# EAGLE schematic Schematic V1 (EAGLE 9.6.2)

## Sheet 1 of 4
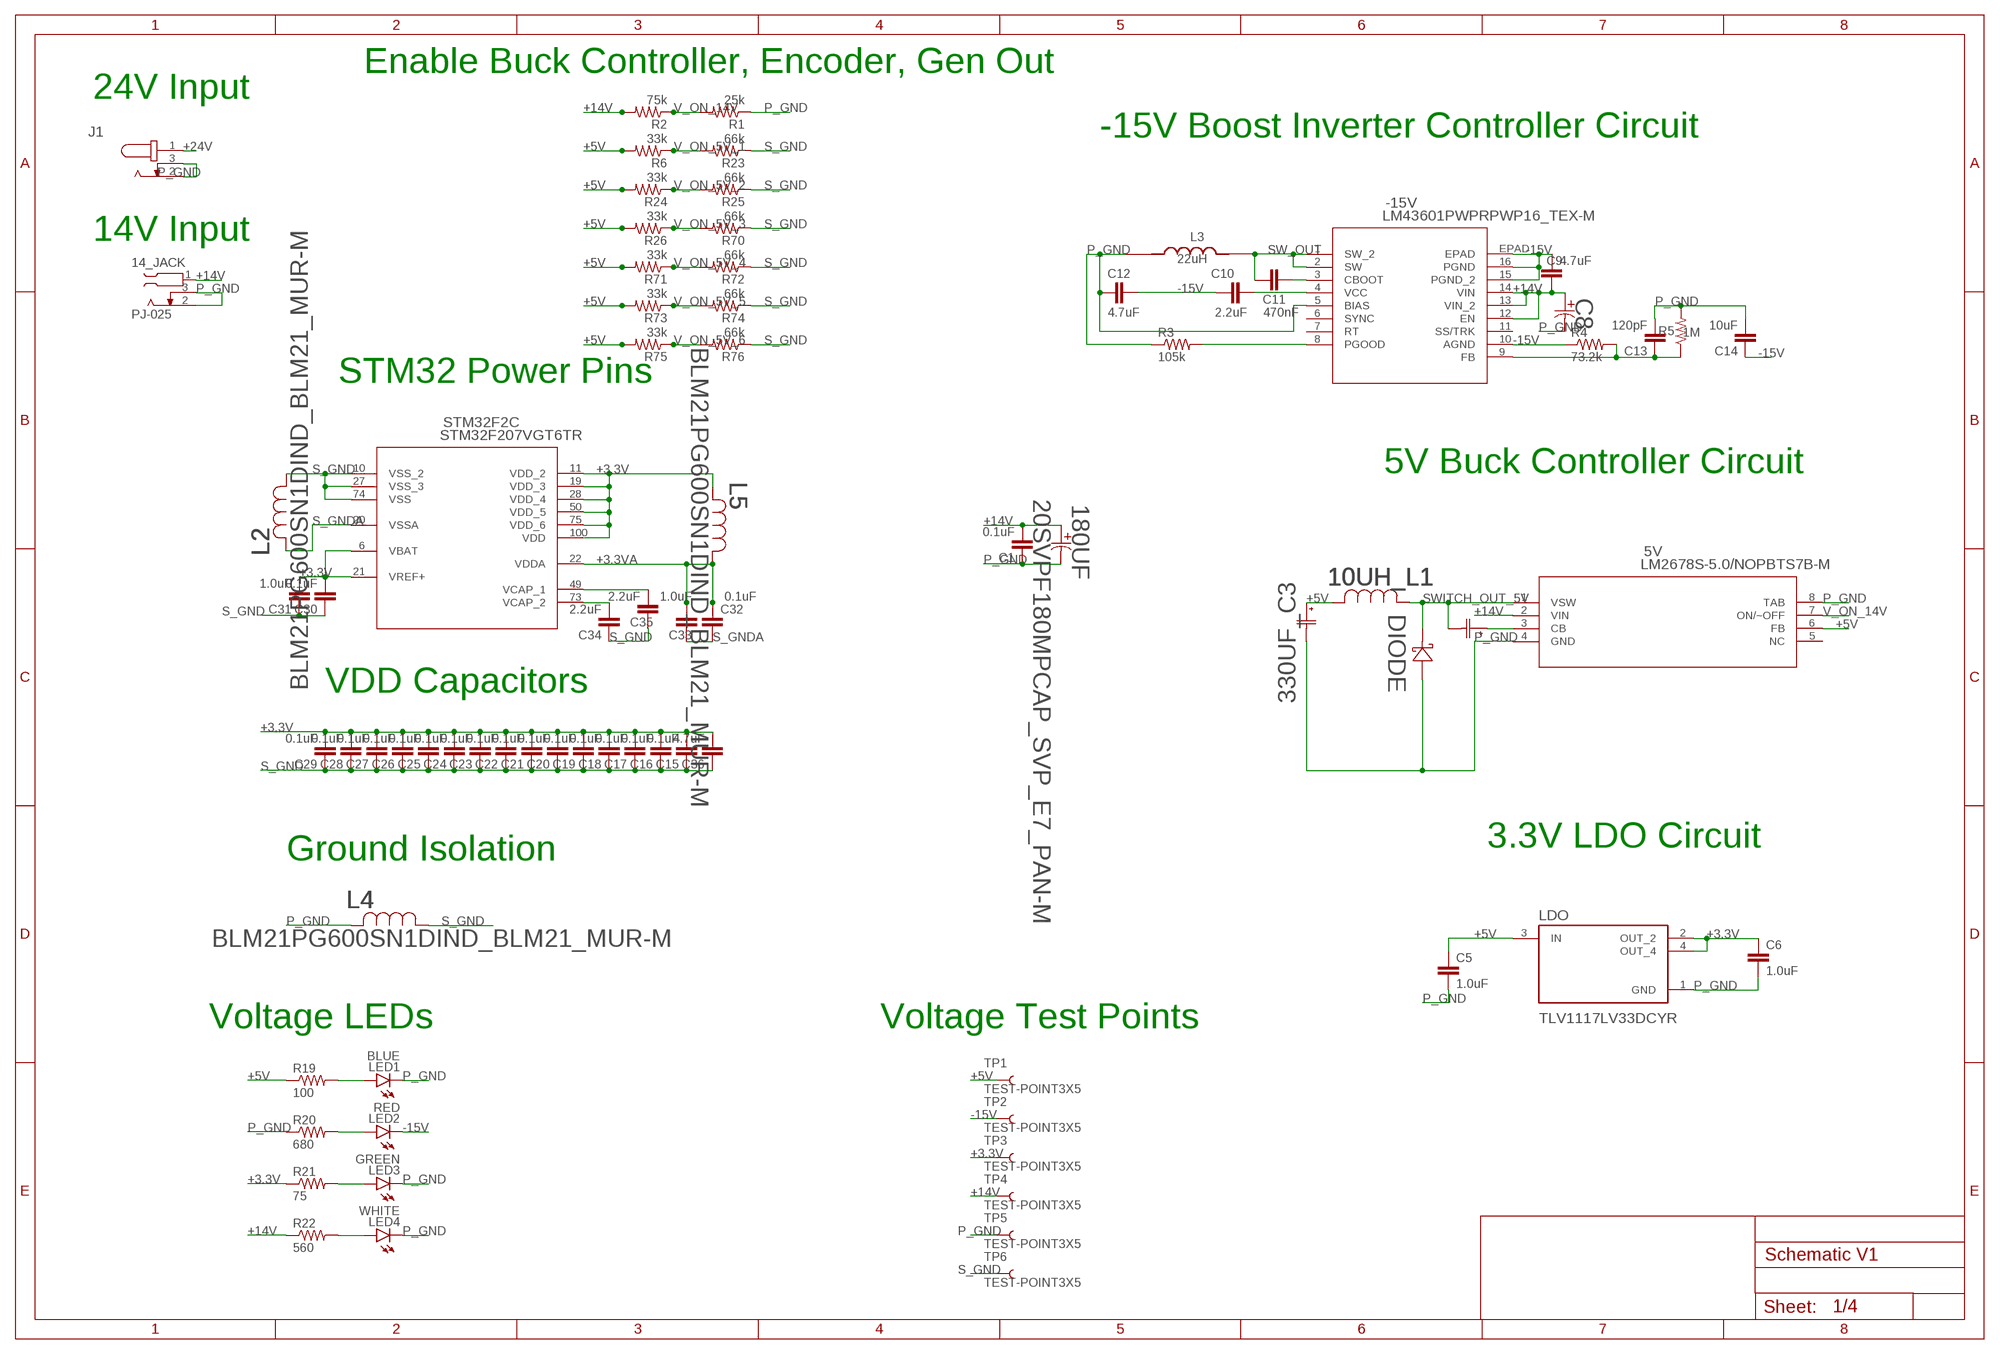
[diagram p0: schematic, sheet 1]

### Parts
0.01UF_C7  GRM2195C1H103JA01DG-21_MUR-M  [G-21_MUR-M]
5V  LM2678S-5.0/NOPBTS7B-M  [TS7B-M]
10UH_L1  SRP1270-100MIND_BOURNS_SRP1270-M  [IND_BOURNS_SRP1270-M]
14_JACK  PJ-025  [CUI_PJ-025]
180UF  20SVPF180MPCAP_SVP_E7_PAN-M  [PCAP_SVP_E7_PAN-M]
330UF_C3  10SVPC330MCAP_SVPC_E7_PAN-M  [CAP_SVPC_E7_PAN-M]
-15V  LM43601PWPRPWP16_TEX-M  [PWP16_TEX-M]
C1  0.1uF  1.0UF-0805-25V-(+80/-20%)  [0805]
C5  1.0uF  1.0UF-0805-25V-(+80/-20%)  [0805]
C6  1.0uF  1.0UF-0805-25V-(+80/-20%)  [0805]
C8  68uF  UWD1V680MCL1GSPCAP_6.3X7.7-ELECT_NCA-M  [PCAP_6.3X7.7-ELECT_NCA-M]
C9  4.7uF  4.7UF-0805-50V-(10%)  [0805]
C10  2.2uF  2.2UF-0805-25V-(+80/-20%)  [0805]
C11  470nF  470NF-0805-100V-10%-X7S  [0805]
C12  4.7uF  4.7UF-0805-50V-(10%)  [0805]
C13  120pF  4.7UF-0805-50V-(10%)  [0805]
C14  10uF  4.7UF-0805-50V-(10%)  [0805]
C15  0.1uF  1.0UF-0805-25V-10%  [0805]
C16  0.1uF  1.0UF-0805-25V-10%  [0805]
C17  0.1uF  1.0UF-0805-25V-10%  [0805]
C18  0.1uF  1.0UF-0805-25V-10%  [0805]
C19  0.1uF  1.0UF-0805-25V-10%  [0805]
C20  0.1uF  1.0UF-0805-25V-10%  [0805]
C21  0.1uF  1.0UF-0805-25V-10%  [0805]
C22  0.1uF  1.0UF-0805-25V-10%  [0805]
C23  0.1uF  1.0UF-0805-25V-10%  [0805]
C24  0.1uF  1.0UF-0805-25V-10%  [0805]
C25  0.1uF  1.0UF-0805-25V-10%  [0805]
C26  0.1uF  1.0UF-0805-25V-10%  [0805]
C27  0.1uF  1.0UF-0805-25V-10%  [0805]
C28  0.1uF  1.0UF-0805-25V-10%  [0805]
C29  0.1uF  1.0UF-0805-25V-10%  [0805]
C30  0.1uF  1.0UF-0805-25V-10%  [0805]
C31  1.0uF  1.0UF-0805-25V-10%  [0805]
C32  0.1uF  1.0UF-0805-25V-10%  [0805]
C33  1.0uF  1.0UF-0805-25V-10%  [0805]
C34  2.2uF  2.2UF-0805-25V-(+80/-20%)  [0805]
C35  2.2uF  2.2UF-0805-25V-(+80/-20%)  [0805]
C36  4.7uF  2.2UF-0805-25V-(+80/-20%)  [0805]
DIODE  CDBC520-GCDBC-G-M  [CDBC-G-M]
J1  PJ-202AH  [CUI_PJ-202AH]
L2  BLM21PG600SN1DIND_BLM21_MUR-M  [IND_BLM21_MUR-M]
L3  22uH  VLS201610CX-220M-1  [IND_VLS201610CX-220M-1]
L4  BLM21PG600SN1DIND_BLM21_MUR-M  [IND_BLM21_MUR-M]
L5  BLM21PG600SN1DIND_BLM21_MUR-M  [IND_BLM21_MUR-M]
LDO  TLV1117LV33DCYR  [VREG_TLV1117LV33DCYR]
LED1  BLUE  LEDCHIPLED_0805  [CHIPLED_0805]
LED2  RED  LEDCHIPLED_0805  [CHIPLED_0805]
LED3  GREEN  LEDCHIPLED_0805  [CHIPLED_0805]
LED4  WHITE  LEDCHIPLED_0805  [CHIPLED_0805]
R1  25k  R-US_R0805  [R0805]
R2  75k  R-US_R0805  [R0805]
R3  105k  R-US_R0805  [R0805]
R4  73.2k  R-US_R0805  [R0805]
R5  1M  R-US_R0805  [R0805]
R6  33k  R-US_R0805  [R0805]
R19  100  R-US_R0805  [R0805]
R20  680  R-US_R0805  [R0805]
R21  75  R-US_R0805  [R0805]
R22  560  R-US_R0805  [R0805]
R23  66k  R-US_R0805  [R0805]
R24  33k  R-US_R0805  [R0805]
R25  66k  R-US_R0805  [R0805]
R26  33k  R-US_R0805  [R0805]
R70  66k  R-US_R0805  [R0805]
R71  33k  R-US_R0805  [R0805]
R72  66k  R-US_R0805  [R0805]
R73  33k  R-US_R0805  [R0805]
R74  66k  R-US_R0805  [R0805]
R75  33k  R-US_R0805  [R0805]
R76  66k  R-US_R0805  [R0805]
STM32F2  STM32F207VGT6TR  [LQFP100-14X14MM]
TP1  TEST-POINT3X5  [PAD.03X.05]
TP2  TEST-POINT3X5  [PAD.03X.05]
TP3  TEST-POINT3X5  [PAD.03X.05]
TP4  TEST-POINT3X5  [PAD.03X.05]
TP5  TEST-POINT3X5  [PAD.03X.05]
TP6  TEST-POINT3X5  [PAD.03X.05]

### Nets
+3.3V: C6.1 C15.2 C16.2 C17.2 C18.2 C19.2 C20.2 C21.2 C22.2 C23.2 C24.2 C25.2 C26.2 C27.2 C28.2 C29.2 C30.2 C31.2 C36.2 L5.2 LDO.2(OUT_2) LDO.4(OUT_4) R21.1 STM32F2.6(C:VBAT) STM32F2.11(C:VDD_2) STM32F2.19(C:VDD_3) STM32F2.21(C:VREF+) STM32F2.28(C:VDD_4) STM32F2.50(C:VDD_5) STM32F2.75(C:VDD_6) STM32F2.100(C:VDD) TP3.1 ; also sheet 3,4
+3.3VA: C32.2 C33.2 L5.1 STM32F2.22(C:VDDA)
+5V: 5V.6(FB) 10UH_L1.2 330UF_C3.1 C5.1 LDO.3(IN) R6.2 R19.1 R24.2 R26.2 R71.2 R73.2 R75.2 TP1.1 ; also sheet 2,3
+14V: 5V.2(VIN) 14_JACK.1 180UF.1 -15V.12(EN) -15V.13(VIN_2) -15V.14(VIN) C1.2 C8.1 C9.2 R2.2 R22.1 TP4.1 ; also sheet 2,3
+24V: J1.1 ; also sheet 2,3,4
-15V: -15V.10(AGND) -15V.15(PGND_2) -15V.16(PGND) -15V.EPAD C9.1 C10.1 C12.1 C14.1 LED2.C R4.1 TP2.1 ; also sheet 2
N$1: -15V.4(VCC) C10.2
N$2: 0.01UF_C7.1 5V.3(CB)
N$3: -15V.3(CBOOT) C11.2
N$4: C35.2 STM32F2.49(C:VCAP_1)
N$5: C34.2 STM32F2.73(C:VCAP_2)
N$7: -15V.8(PGOOD) R3.2
N$11: -15V.9(FB) C13.1 R4.2 R5.1
N$22: LED1.A R19.2
N$23: LED2.A R20.2
N$24: LED3.A R21.2
N$30: LED4.A R22.2
P_GND: 5V.4(GND) 5V.8(TAB) 14_JACK.2 14_JACK.3 180UF.2 330UF_C3.2 -15V.5(BIAS) C1.1 C5.2 C6.2 C8.2 C12.2 C13.2 C14.2 DIODE.2 J1.2 J1.3 L3.1 L4.2 LDO.1(GND) LED1.C LED3.C LED4.C R1.1 R3.1 R5.2 R20.1 TP5.1 ; also sheet 2,4
S_GND: C15.1 C16.1 C17.1 C18.1 C19.1 C20.1 C21.1 C22.1 C23.1 C24.1 C25.1 C26.1 C27.1 C28.1 C29.1 C30.1 C31.1 C34.1 C35.1 C36.1 L2.1 L4.1 R23.1 R25.1 R70.1 R72.1 R74.1 R76.1 STM32F2.10(C:VSS_2) STM32F2.27(C:VSS_3) STM32F2.74(C:VSS) TP6.1 ; also sheet 2,3,4
S_GNDA: C32.1 C33.1 L2.2 STM32F2.20(C:VSSA)
SW_OUT: -15V.1(SW_2) -15V.2(SW) C11.1 L3.2
SWITCH_OUT_5V: 0.01UF_C7.2 5V.1(VSW) 10UH_L1.1 DIODE.1
V_ON_5V_1: R6.1 R23.2 ; also sheet 3
V_ON_5V_2: R24.1 R25.2 ; also sheet 2
V_ON_5V_3: R26.1 R70.2 ; also sheet 3
V_ON_5V_4: R71.1 R72.2 ; also sheet 3
V_ON_5V_5: R73.1 R74.2 ; also sheet 3
V_ON_5V_6: R75.1 R76.2 ; also sheet 2
V_ON_14V: 5V.7(ON/~OFF) R1.2 R2.1
Unconnected: 5V.5(NC) -15V.6(SYNC) -15V.7(RT) -15V.11(SS/TRK)

### Notes on the sheet
- Enable Buck Controller, Encoder, Gen Out
- 24V Input
- -15V Boost Inverter Controller Circuit
- 14V Input
- STM32 Power Pins
- 5V Buck Controller Circuit
- VDD Capacitors
- 3.3V LDO Circuit
- Ground Isolation
- Voltage LEDs | Voltage Test Points

## Sheet 2 of 4
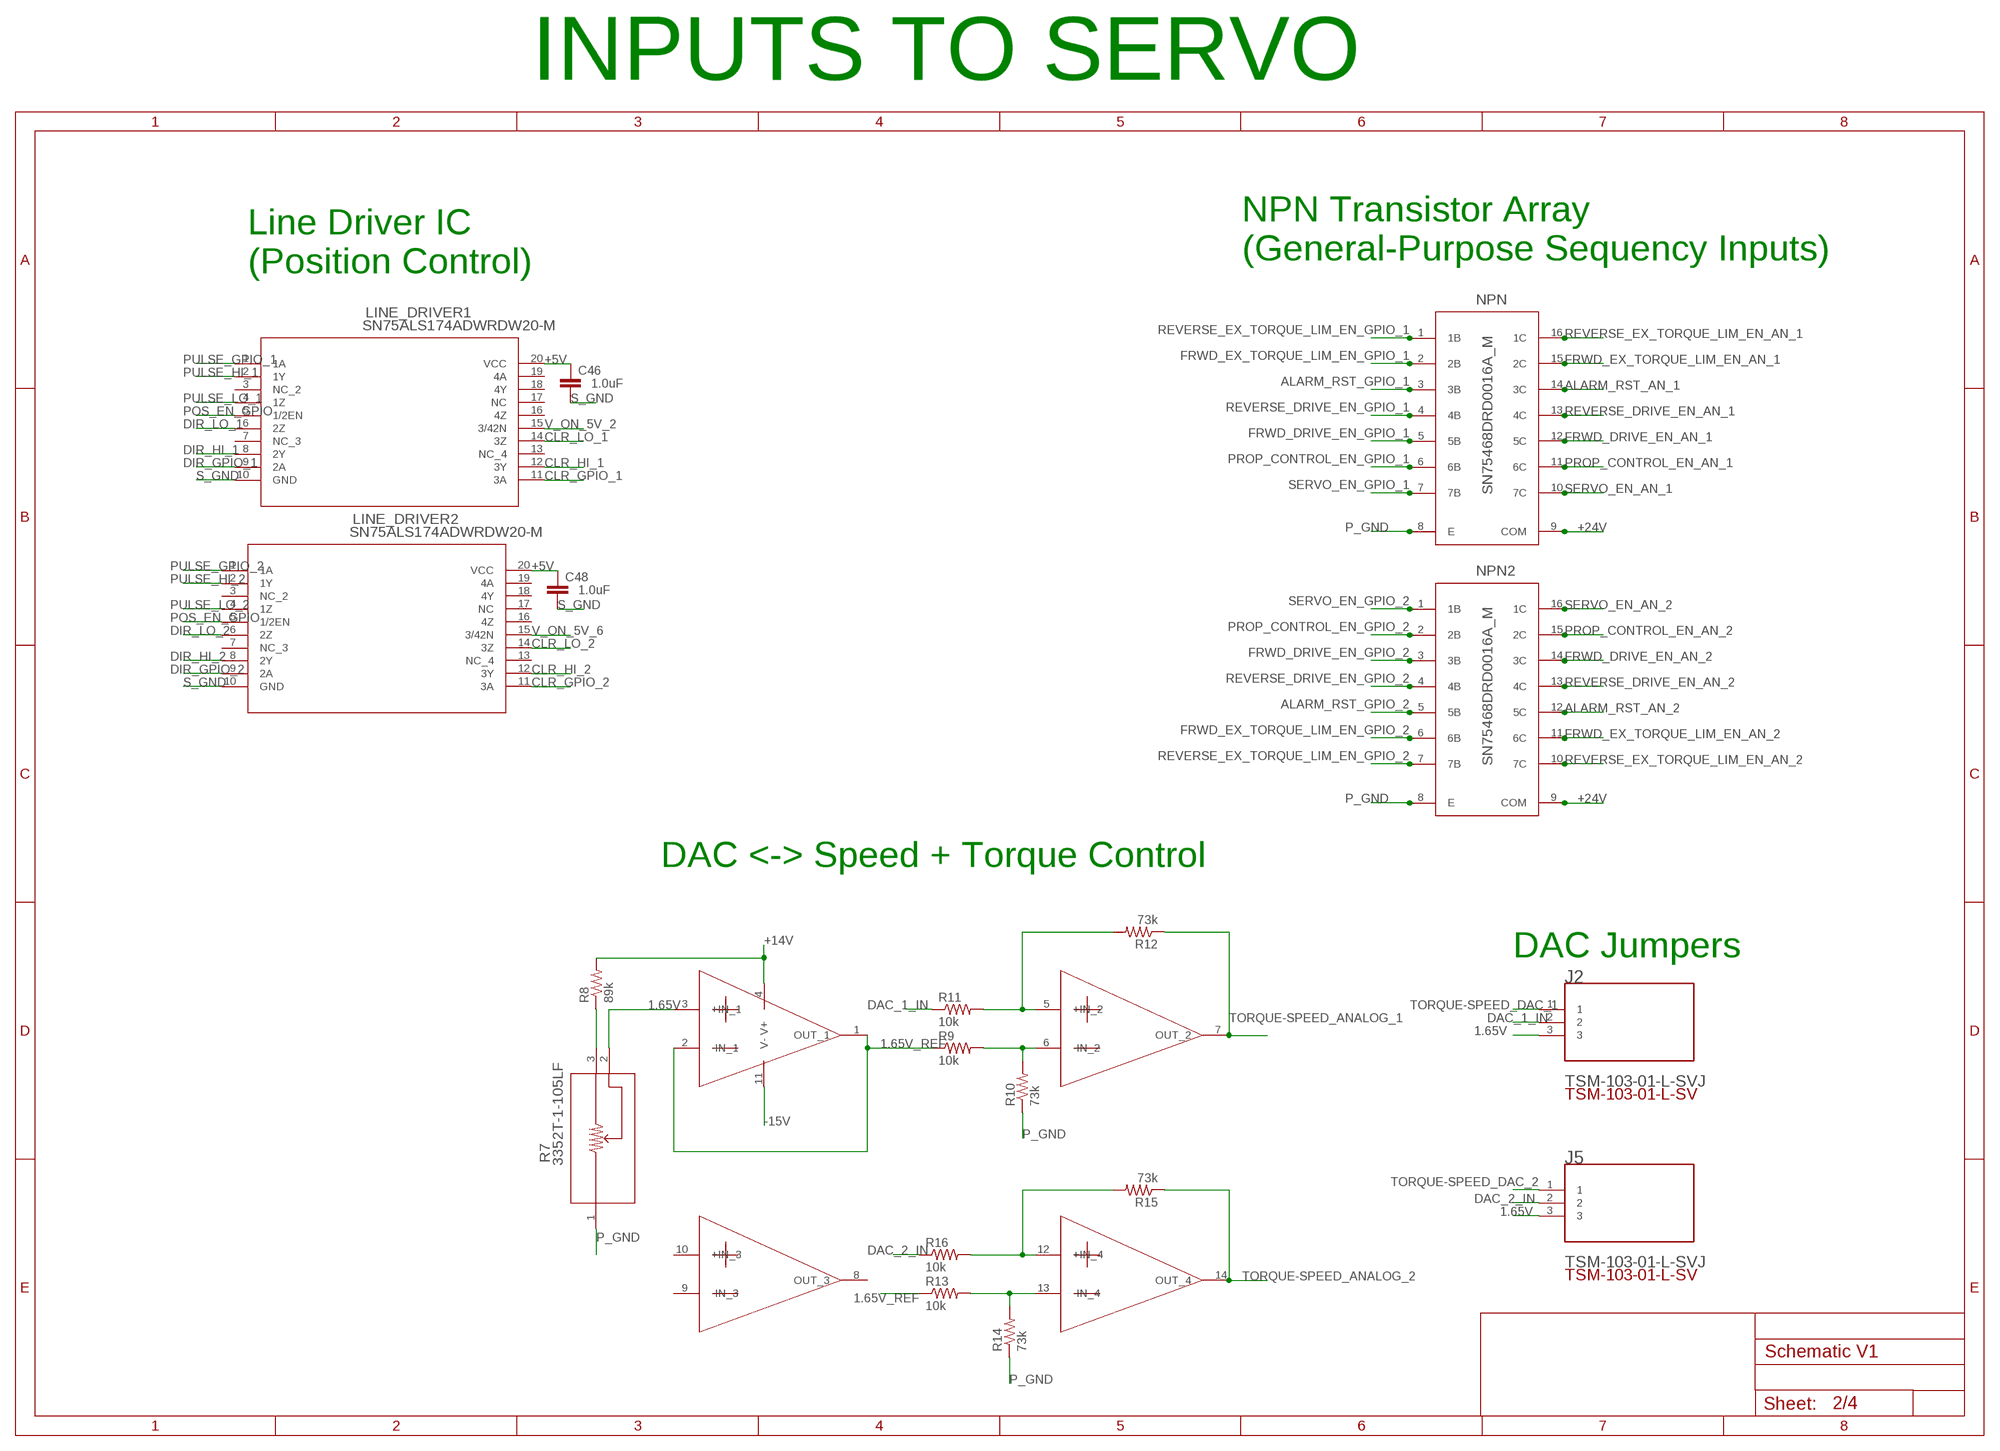
[diagram p1: schematic, sheet 2]

### Parts
C46  1.0uF  1.0UF-0805-25V-10%  [0805]
C48  1.0uF  1.0UF-0805-25V-10%  [0805]
J2  TSM-103-01-L-SVJ  [TSM-103-01-L-SV]
J5  TSM-103-01-L-SVJ  [TSM-103-01-L-SV]
LINE_DRIVER1  SN75ALS174ADWRDW20-M  [DW20-M]
LINE_DRIVER2  SN75ALS174ADWRDW20-M  [DW20-M]
NPN  SN75468DRD0016A_M  [D0016A_M]
NPN2  SN75468DRD0016A_M  [D0016A_M]
OP_AMP  OPA4205APWRTSSOP14_PW_R-PDSO-G14_TEX-M  [TSSOP14_PW_R-PDSO-G14_TEX-M]
R7  3352T-1-105LF  [3352T_BRN]
R8  89k  R-US_R0805  [R0805]
R9  10k  R-US_R0805  [R0805]
R10  73k  R-US_R0805  [R0805]
R11  10k  R-US_R0805  [R0805]
R12  73k  R-US_R0805  [R0805]
R13  10k  R-US_R0805  [R0805]
R14  73k  R-US_R0805  [R0805]
R15  73k  R-US_R0805  [R0805]
R16  10k  R-US_R0805  [R0805]

### Nets
1.65V: J2.3 J5.3 OP_AMP.3(+IN_1) R7.2
1.65V_REF: OP_AMP.1(OUT_1) OP_AMP.2(-IN_1) R9.1 R13.1
+5V: C46.2 C48.2 LINE_DRIVER1.20(VCC) LINE_DRIVER2.20(VCC) ; also sheet 1,3
+14V: OP_AMP.4(V+) R8.2 ; also sheet 1,3
+24V: NPN2.9(COM) NPN.9(COM) ; also sheet 1,3,4
-15V: OP_AMP.11(V-) ; also sheet 1
ALARM_RST_AN_1: NPN.14(3C) ; also sheet 4
ALARM_RST_AN_2: NPN2.12(5C) ; also sheet 4
ALARM_RST_GPIO_1: NPN.3(3B) ; also sheet 4
ALARM_RST_GPIO_2: NPN2.5(5B) ; also sheet 4
CLR_GPIO_1: LINE_DRIVER1.11(3A) ; also sheet 4
CLR_GPIO_2: LINE_DRIVER2.11(3A) ; also sheet 4
CLR_HI_1: LINE_DRIVER1.12(3Y) ; also sheet 4
CLR_HI_2: LINE_DRIVER2.12(3Y) ; also sheet 4
CLR_LO_1: LINE_DRIVER1.14(3Z) ; also sheet 4
CLR_LO_2: LINE_DRIVER2.14(3Z) ; also sheet 4
DAC_1_IN: J2.2 R11.1
DAC_2_IN: J5.2 R16.1
DIR_GPIO_1: LINE_DRIVER1.9(2A) ; also sheet 4
DIR_GPIO_2: LINE_DRIVER2.9(2A) ; also sheet 4
DIR_HI_1: LINE_DRIVER1.8(2Y) ; also sheet 4
DIR_HI_2: LINE_DRIVER2.8(2Y) ; also sheet 4
DIR_LO_1: LINE_DRIVER1.6(2Z) ; also sheet 4
DIR_LO_2: LINE_DRIVER2.6(2Z) ; also sheet 4
FRWD_DRIVE_EN_AN_1: NPN.12(5C) ; also sheet 4
FRWD_DRIVE_EN_AN_2: NPN2.14(3C) ; also sheet 4
FRWD_DRIVE_EN_GPIO_1: NPN.5(5B) ; also sheet 4
FRWD_DRIVE_EN_GPIO_2: NPN2.3(3B) ; also sheet 4
FRWD_EX_TORQUE_LIM_EN_AN_1: NPN.15(2C) ; also sheet 4
FRWD_EX_TORQUE_LIM_EN_AN_2: NPN2.11(6C) ; also sheet 4
FRWD_EX_TORQUE_LIM_EN_GPIO_1: NPN.2(2B) ; also sheet 4
FRWD_EX_TORQUE_LIM_EN_GPIO_2: NPN2.6(6B) ; also sheet 4
N$8: OP_AMP.6(-IN_2) R9.2 R10.2
N$13: R7.3 R8.1
N$15: OP_AMP.5(+IN_2) R11.2 R12.2
N$17: OP_AMP.13(-IN_4) R13.2 R14.2
N$18: OP_AMP.12(+IN_4) R15.2 R16.2
P_GND: NPN2.8(E) NPN.8(E) R7.1 R10.1 R14.1 ; also sheet 1,4
POS_EN_GPIO: LINE_DRIVER1.5(1/2EN) LINE_DRIVER2.5(1/2EN) ; also sheet 4
PROP_CONTROL_EN_AN_1: NPN.11(6C) ; also sheet 4
PROP_CONTROL_EN_AN_2: NPN2.15(2C) ; also sheet 4
PROP_CONTROL_EN_GPIO_1: NPN.6(6B) ; also sheet 4
PROP_CONTROL_EN_GPIO_2: NPN2.2(2B) ; also sheet 4
PULSE_GPIO_1: LINE_DRIVER1.1(1A) ; also sheet 4
PULSE_GPIO_2: LINE_DRIVER2.1(1A) ; also sheet 4
PULSE_HI_1: LINE_DRIVER1.2(1Y) ; also sheet 4
PULSE_HI_2: LINE_DRIVER2.2(1Y) ; also sheet 4
PULSE_LO_1: LINE_DRIVER1.4(1Z) ; also sheet 4
PULSE_LO_2: LINE_DRIVER2.4(1Z) ; also sheet 4
REVERSE_DRIVE_EN_AN_1: NPN.13(4C) ; also sheet 4
REVERSE_DRIVE_EN_AN_2: NPN2.13(4C) ; also sheet 4
REVERSE_DRIVE_EN_GPIO_1: NPN.4(4B) ; also sheet 4
REVERSE_DRIVE_EN_GPIO_2: NPN2.4(4B) ; also sheet 4
REVERSE_EX_TORQUE_LIM_EN_AN_1: NPN.16(1C) ; also sheet 4
REVERSE_EX_TORQUE_LIM_EN_AN_2: NPN2.10(7C) ; also sheet 4
REVERSE_EX_TORQUE_LIM_EN_GPIO_1: NPN.1(1B) ; also sheet 4
REVERSE_EX_TORQUE_LIM_EN_GPIO_2: NPN2.7(7B) ; also sheet 4
S_GND: C46.1 C48.1 LINE_DRIVER1.10(GND) LINE_DRIVER2.10(GND) ; also sheet 1,3,4
SERVO_EN_AN_1: NPN.10(7C) ; also sheet 4
SERVO_EN_AN_2: NPN2.16(1C) ; also sheet 4
SERVO_EN_GPIO_1: NPN.7(7B) ; also sheet 4
SERVO_EN_GPIO_2: NPN2.1(1B) ; also sheet 4
TORQUE-SPEED_ANALOG_1: OP_AMP.7(OUT_2) R12.1 ; also sheet 4
TORQUE-SPEED_ANALOG_2: OP_AMP.14(OUT_4) R15.1 ; also sheet 4
TORQUE-SPEED_DAC_1: J2.1 ; also sheet 4
TORQUE-SPEED_DAC_2: J5.1 ; also sheet 4
V_ON_5V_2: LINE_DRIVER1.15(3/42N) ; also sheet 1
V_ON_5V_6: LINE_DRIVER2.15(3/42N) ; also sheet 1
Unconnected: LINE_DRIVER1.3(NC_2) LINE_DRIVER1.7(NC_3) LINE_DRIVER1.13(NC_4) LINE_DRIVER1.16(4Z) LINE_DRIVER1.17(NC) LINE_DRIVER1.18(4Y) LINE_DRIVER1.19(4A) LINE_DRIVER2.3(NC_2) LINE_DRIVER2.7(NC_3) LINE_DRIVER2.13(NC_4) LINE_DRIVER2.16(4Z) LINE_DRIVER2.17(NC) LINE_DRIVER2.18(4Y) LINE_DRIVER2.19(4A) OP_AMP.8(OUT_3) OP_AMP.9(-IN_3) OP_AMP.10(+IN_3)

### Notes on the sheet
- INPUTS TO SERVO
- NPN Transistor Array
  (General-Purpose Sequency Inputs)
- Line Driver IC
  (Position Control)
- DAC <-> Speed + Torque Control
- DAC Jumpers

## Sheet 3 of 4
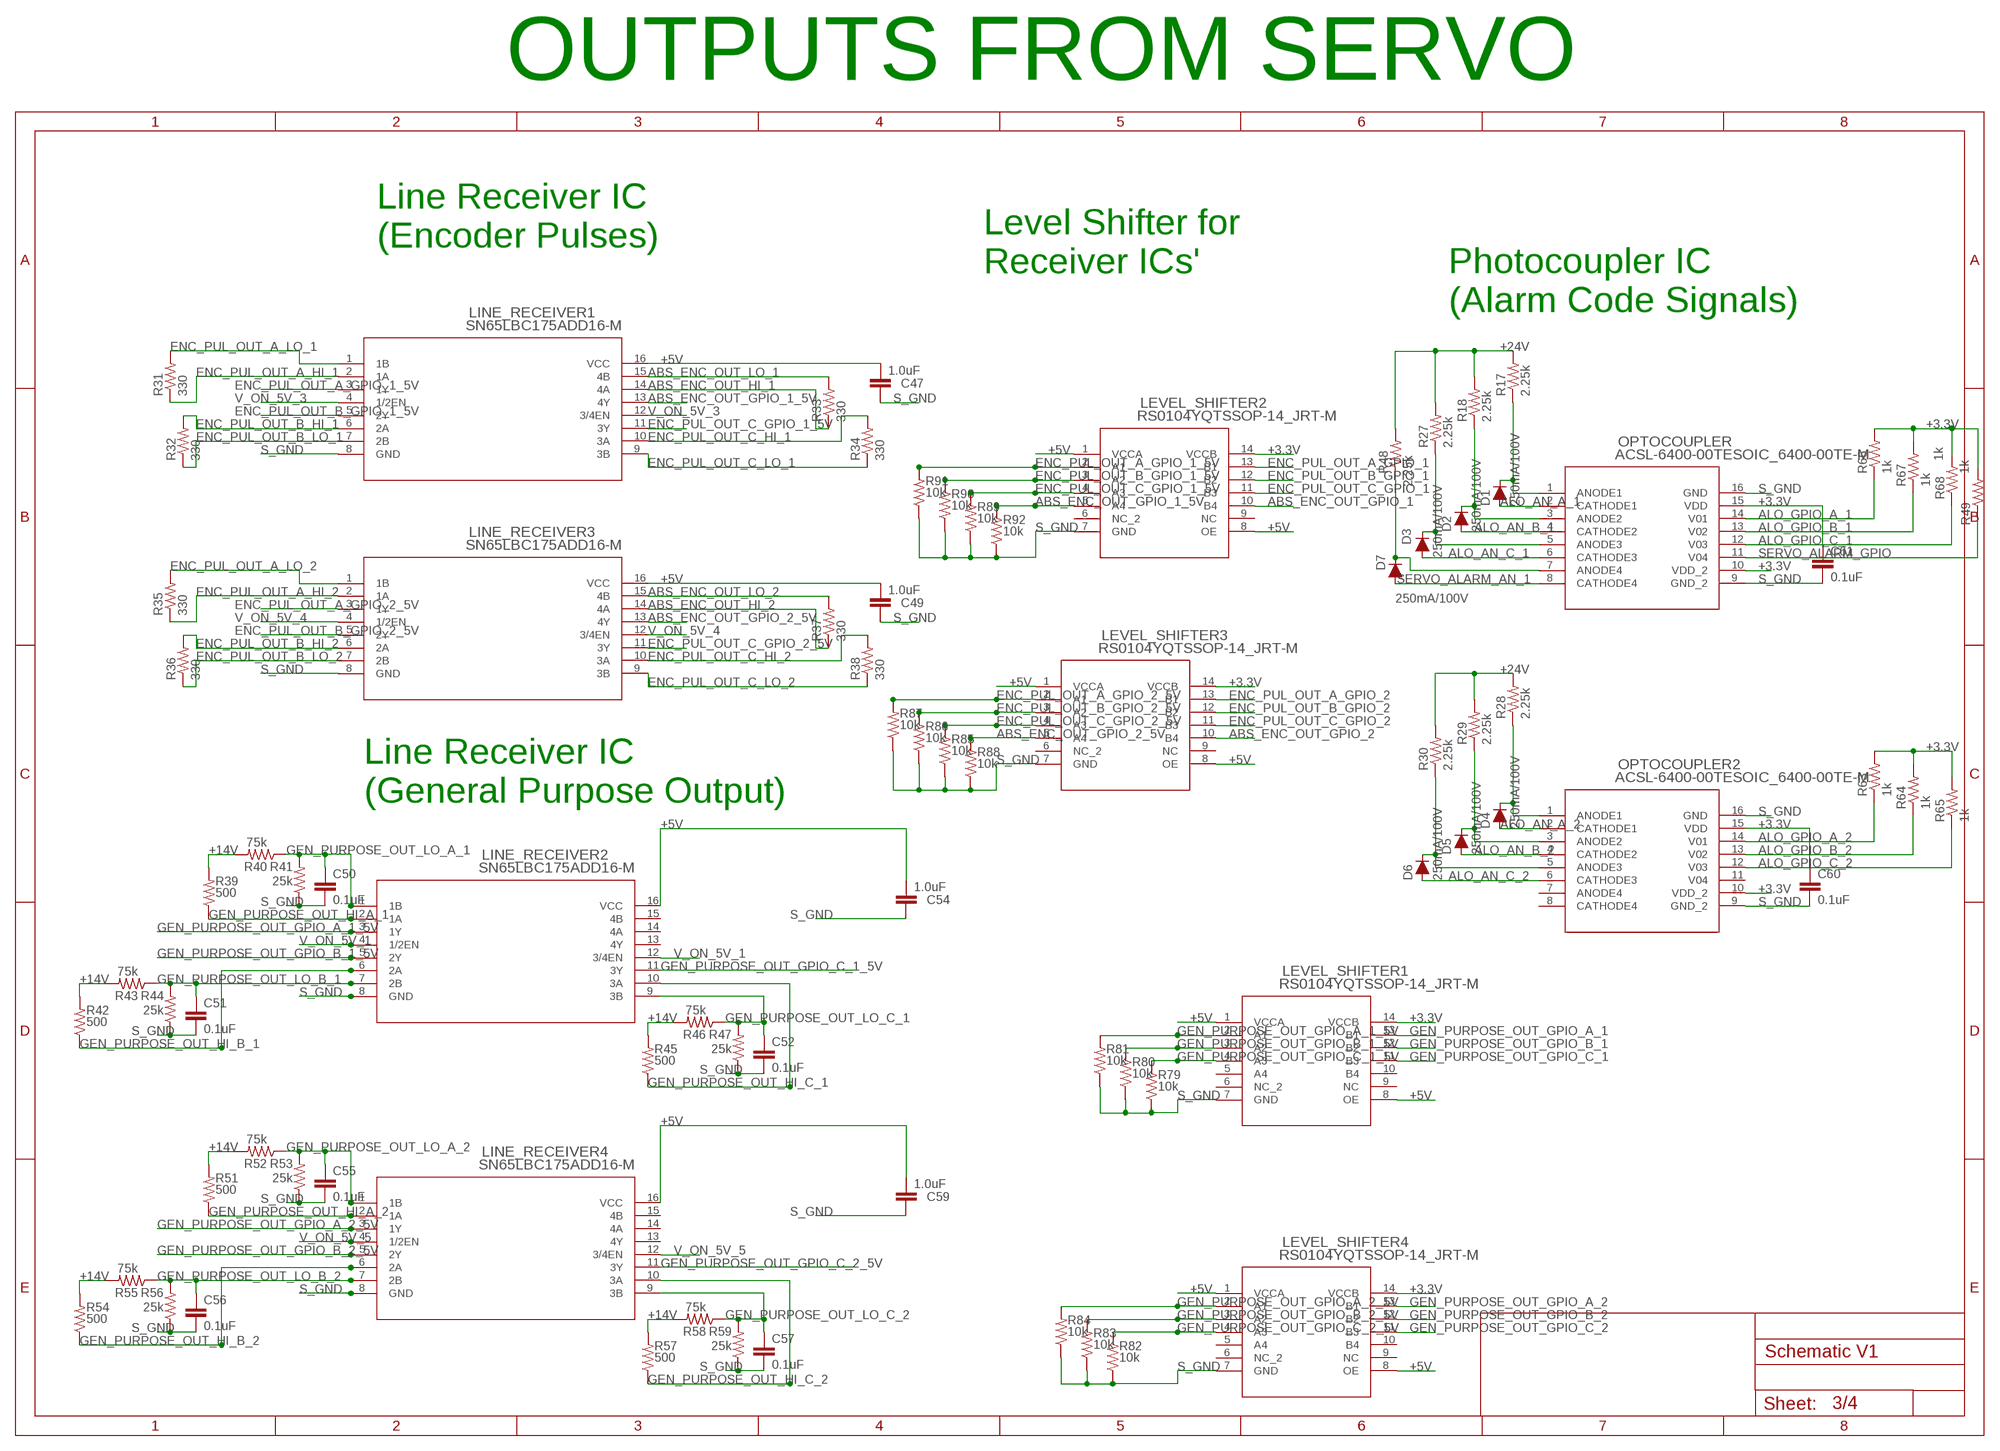
[diagram p2: schematic, sheet 3]

### Parts
C47  1.0uF  1.0UF-0805-25V-10%  [0805]
C49  1.0uF  1.0UF-0805-25V-10%  [0805]
C50  0.1uF  1.0UF-0805-25V-10%  [0805]
C51  0.1uF  1.0UF-0805-25V-10%  [0805]
C52  0.1uF  1.0UF-0805-25V-10%  [0805]
C54  1.0uF  1.0UF-0805-25V-10%  [0805]
C55  0.1uF  1.0UF-0805-25V-10%  [0805]
C56  0.1uF  1.0UF-0805-25V-10%  [0805]
C57  0.1uF  1.0UF-0805-25V-10%  [0805]
C59  1.0uF  1.0UF-0805-25V-10%  [0805]
C60  0.1uF  1.0UF-0805-25V-10%  [0805]
C61  0.1uF  1.0UF-0805-25V-10%  [0805]
D1  250mA/100V  DIODE-BAS16J  [SOD-323]
D2  250mA/100V  DIODE-BAS16J  [SOD-323]
D3  250mA/100V  DIODE-BAS16J  [SOD-323]
D4  250mA/100V  DIODE-BAS16J  [SOD-323]
D5  250mA/100V  DIODE-BAS16J  [SOD-323]
D6  250mA/100V  DIODE-BAS16J  [SOD-323]
D7  250mA/100V  DIODE-BAS16J  [SOD-323]
LEVEL_SHIFTER1  RS0104YQTSSOP-14_JRT-M  [TSSOP-14_JRT-M]
LEVEL_SHIFTER2  RS0104YQTSSOP-14_JRT-M  [TSSOP-14_JRT-M]
LEVEL_SHIFTER3  RS0104YQTSSOP-14_JRT-M  [TSSOP-14_JRT-M]
LEVEL_SHIFTER4  RS0104YQTSSOP-14_JRT-M  [TSSOP-14_JRT-M]
LINE_RECEIVER1  SN65LBC175ADD16-M  [D16-M]
LINE_RECEIVER2  SN65LBC175ADD16-M  [D16-M]
LINE_RECEIVER3  SN65LBC175ADD16-M  [D16-M]
LINE_RECEIVER4  SN65LBC175ADD16-M  [D16-M]
OPTOCOUPLER  ACSL-6400-00TESOIC_6400-00TE-M  [SOIC_6400-00TE-M]
OPTOCOUPLER2  ACSL-6400-00TESOIC_6400-00TE-M  [SOIC_6400-00TE-M]
R17  2.25k  R-US_R0805  [R0805]
R18  2.25k  R-US_R0805  [R0805]
R27  2.25k  R-US_R0805  [R0805]
R28  2.25k  R-US_R0805  [R0805]
R29  2.25k  R-US_R0805  [R0805]
R30  2.25k  R-US_R0805  [R0805]
R31  330  R-US_R0805  [R0805]
R32  330  R-US_R0805  [R0805]
R33  330  R-US_R0805  [R0805]
R34  330  R-US_R0805  [R0805]
R35  330  R-US_R0805  [R0805]
R36  330  R-US_R0805  [R0805]
R37  330  R-US_R0805  [R0805]
R38  330  R-US_R0805  [R0805]
R39  500  R-US_R0805  [R0805]
R40  75k  R-US_R0805  [R0805]
R41  25k  R-US_R0805  [R0805]
R42  500  R-US_R0805  [R0805]
R43  75k  R-US_R0805  [R0805]
R44  25k  R-US_R0805  [R0805]
R45  500  R-US_R0805  [R0805]
R46  75k  R-US_R0805  [R0805]
R47  25k  R-US_R0805  [R0805]
R48  2.25k  R-US_R0805  [R0805]
R49  1k  R-US_R0805  [R0805]
R51  500  R-US_R0805  [R0805]
R52  75k  R-US_R0805  [R0805]
R53  25k  R-US_R0805  [R0805]
R54  500  R-US_R0805  [R0805]
R55  75k  R-US_R0805  [R0805]
R56  25k  R-US_R0805  [R0805]
R57  500  R-US_R0805  [R0805]
R58  75k  R-US_R0805  [R0805]
R59  25k  R-US_R0805  [R0805]
R63  1k  R-US_R0805  [R0805]
R64  1k  R-US_R0805  [R0805]
R65  1k  R-US_R0805  [R0805]
R66  1k  R-US_R0805  [R0805]
R67  1k  R-US_R0805  [R0805]
R68  1k  R-US_R0805  [R0805]
R79  10k  R-US_R0805  [R0805]
R80  10k  R-US_R0805  [R0805]
R81  10k  R-US_R0805  [R0805]
R82  10k  R-US_R0805  [R0805]
R83  10k  R-US_R0805  [R0805]
R84  10k  R-US_R0805  [R0805]
R85  10k  R-US_R0805  [R0805]
R86  10k  R-US_R0805  [R0805]
R87  10k  R-US_R0805  [R0805]
R88  10k  R-US_R0805  [R0805]
R89  10k  R-US_R0805  [R0805]
R90  10k  R-US_R0805  [R0805]
R91  10k  R-US_R0805  [R0805]
R92  10k  R-US_R0805  [R0805]

### Nets
+3.3V: C60.2 C61.2 LEVEL_SHIFTER1.14(VCCB) LEVEL_SHIFTER2.14(VCCB) LEVEL_SHIFTER3.14(VCCB) LEVEL_SHIFTER4.14(VCCB) OPTOCOUPLER2.10(VDD_2) OPTOCOUPLER2.15(VDD) OPTOCOUPLER.10(VDD_2) OPTOCOUPLER.15(VDD) R49.2 R63.2 R64.2 R65.2 R66.2 R67.2 R68.2 ; also sheet 1,4
+5V: C47.2 C49.2 C54.2 C59.2 LEVEL_SHIFTER1.1(VCCA) LEVEL_SHIFTER1.8(OE) LEVEL_SHIFTER2.1(VCCA) LEVEL_SHIFTER2.8(OE) LEVEL_SHIFTER3.1(VCCA) LEVEL_SHIFTER3.8(OE) LEVEL_SHIFTER4.1(VCCA) LEVEL_SHIFTER4.8(OE) LINE_RECEIVER1.16(VCC) LINE_RECEIVER2.16(VCC) LINE_RECEIVER3.16(VCC) LINE_RECEIVER4.16(VCC) ; also sheet 1,2
+14V: R39.2 R40.2 R42.2 R43.2 R45.2 R46.2 R51.2 R52.2 R54.2 R55.2 R57.2 R58.2 ; also sheet 1,2
+24V: R17.2 R18.2 R27.2 R28.2 R29.2 R30.2 R48.2 ; also sheet 1,2,4
ABS_ENC_OUT_GPIO_1: LEVEL_SHIFTER2.10(B4) ; also sheet 4
ABS_ENC_OUT_GPIO_1_5V: LEVEL_SHIFTER2.5(A4) LINE_RECEIVER1.13(4Y) R92.2
ABS_ENC_OUT_GPIO_2: LEVEL_SHIFTER3.10(B4) ; also sheet 4
ABS_ENC_OUT_GPIO_2_5V: LEVEL_SHIFTER3.5(A4) LINE_RECEIVER3.13(4Y) R88.2
ABS_ENC_OUT_HI_1: LINE_RECEIVER1.14(4A) R33.1 ; also sheet 4
ABS_ENC_OUT_HI_2: LINE_RECEIVER3.14(4A) R37.1 ; also sheet 4
ABS_ENC_OUT_LO_1: LINE_RECEIVER1.15(4B) R33.2 ; also sheet 4
ABS_ENC_OUT_LO_2: LINE_RECEIVER3.15(4B) R37.2 ; also sheet 4
ALO_AN_A_1: D1.A OPTOCOUPLER.2(CATHODE1) ; also sheet 4
ALO_AN_A_2: D4.A OPTOCOUPLER2.2(CATHODE1) ; also sheet 4
ALO_AN_B_1: D2.A OPTOCOUPLER.4(CATHODE2) ; also sheet 4
ALO_AN_B_2: D5.A OPTOCOUPLER2.4(CATHODE2) ; also sheet 4
ALO_AN_C_1: D3.A OPTOCOUPLER.6(CATHODE3) ; also sheet 4
ALO_AN_C_2: D6.A OPTOCOUPLER2.6(CATHODE3) ; also sheet 4
ALO_GPIO_A_1: OPTOCOUPLER.14(V01) R66.1 ; also sheet 4
ALO_GPIO_A_2: OPTOCOUPLER2.14(V01) R63.1 ; also sheet 4
ALO_GPIO_B_1: OPTOCOUPLER.13(V02) R67.1 ; also sheet 4
ALO_GPIO_B_2: OPTOCOUPLER2.13(V02) R64.1 ; also sheet 4
ALO_GPIO_C_1: OPTOCOUPLER.12(V03) R68.1 ; also sheet 4
ALO_GPIO_C_2: OPTOCOUPLER2.12(V03) R65.1 ; also sheet 4
ENC_PUL_OUT_A_GPIO_1: LEVEL_SHIFTER2.13(B1) ; also sheet 4
ENC_PUL_OUT_A_GPIO_1_5V: LEVEL_SHIFTER2.2(A1) LINE_RECEIVER1.3(1Y) R91.2
ENC_PUL_OUT_A_GPIO_2: LEVEL_SHIFTER3.13(B1) ; also sheet 4
ENC_PUL_OUT_A_GPIO_2_5V: LEVEL_SHIFTER3.2(A1) LINE_RECEIVER3.3(1Y) R87.2
ENC_PUL_OUT_A_HI_1: LINE_RECEIVER1.2(1A) R31.1 ; also sheet 4
ENC_PUL_OUT_A_HI_2: LINE_RECEIVER3.2(1A) R35.1 ; also sheet 4
ENC_PUL_OUT_A_LO_1: LINE_RECEIVER1.1(1B) R31.2 ; also sheet 4
ENC_PUL_OUT_A_LO_2: LINE_RECEIVER3.1(1B) R35.2 ; also sheet 4
ENC_PUL_OUT_B_GPIO_1: LEVEL_SHIFTER2.12(B2) ; also sheet 4
ENC_PUL_OUT_B_GPIO_1_5V: LEVEL_SHIFTER2.3(A2) LINE_RECEIVER1.5(2Y) R90.2
ENC_PUL_OUT_B_GPIO_2: LEVEL_SHIFTER3.12(B2) ; also sheet 4
ENC_PUL_OUT_B_GPIO_2_5V: LEVEL_SHIFTER3.3(A2) LINE_RECEIVER3.5(2Y) R86.2
ENC_PUL_OUT_B_HI_1: LINE_RECEIVER1.6(2A) R32.2 ; also sheet 4
ENC_PUL_OUT_B_HI_2: LINE_RECEIVER3.6(2A) R36.2 ; also sheet 4
ENC_PUL_OUT_B_LO_1: LINE_RECEIVER1.7(2B) R32.1 ; also sheet 4
ENC_PUL_OUT_B_LO_2: LINE_RECEIVER3.7(2B) R36.1 ; also sheet 4
ENC_PUL_OUT_C_GPIO_1: LEVEL_SHIFTER2.11(B3) ; also sheet 4
ENC_PUL_OUT_C_GPIO_1_5V: LEVEL_SHIFTER2.4(A3) LINE_RECEIVER1.11(3Y) R89.2
ENC_PUL_OUT_C_GPIO_2: LEVEL_SHIFTER3.11(B3) ; also sheet 4
ENC_PUL_OUT_C_GPIO_2_5V: LEVEL_SHIFTER3.4(A3) LINE_RECEIVER3.11(3Y) R85.2
ENC_PUL_OUT_C_HI_1: LINE_RECEIVER1.10(3A) R34.2 ; also sheet 4
ENC_PUL_OUT_C_HI_2: LINE_RECEIVER3.10(3A) R38.2 ; also sheet 4
ENC_PUL_OUT_C_LO_1: LINE_RECEIVER1.9(3B) R34.1 ; also sheet 4
ENC_PUL_OUT_C_LO_2: LINE_RECEIVER3.9(3B) R38.1 ; also sheet 4
GEN_PURPOSE_OUT_GPIO_A_1: LEVEL_SHIFTER1.13(B1) ; also sheet 4
GEN_PURPOSE_OUT_GPIO_A_1_5V: LEVEL_SHIFTER1.2(A1) LINE_RECEIVER2.3(1Y) R81.2
GEN_PURPOSE_OUT_GPIO_A_2: LEVEL_SHIFTER4.13(B1) ; also sheet 4
GEN_PURPOSE_OUT_GPIO_A_2_5V: LEVEL_SHIFTER4.2(A1) LINE_RECEIVER4.3(1Y) R84.2
GEN_PURPOSE_OUT_GPIO_B_1: LEVEL_SHIFTER1.12(B2) ; also sheet 4
GEN_PURPOSE_OUT_GPIO_B_1_5V: LEVEL_SHIFTER1.3(A2) LINE_RECEIVER2.5(2Y) R80.2
GEN_PURPOSE_OUT_GPIO_B_2: LEVEL_SHIFTER4.12(B2) ; also sheet 4
GEN_PURPOSE_OUT_GPIO_B_2_5V: LEVEL_SHIFTER4.3(A2) LINE_RECEIVER4.5(2Y) R83.2
GEN_PURPOSE_OUT_GPIO_C_1: LEVEL_SHIFTER1.11(B3) ; also sheet 4
GEN_PURPOSE_OUT_GPIO_C_1_5V: LEVEL_SHIFTER1.4(A3) LINE_RECEIVER2.11(3Y) R79.2
GEN_PURPOSE_OUT_GPIO_C_2: LEVEL_SHIFTER4.11(B3) ; also sheet 4
GEN_PURPOSE_OUT_GPIO_C_2_5V: LEVEL_SHIFTER4.4(A3) LINE_RECEIVER4.11(3Y) R82.2
GEN_PURPOSE_OUT_HI_A_1: LINE_RECEIVER2.2(1A) R39.1 ; also sheet 4
GEN_PURPOSE_OUT_HI_A_2: LINE_RECEIVER4.2(1A) R51.1 ; also sheet 4
GEN_PURPOSE_OUT_HI_B_1: LINE_RECEIVER2.6(2A) R42.1 ; also sheet 4
GEN_PURPOSE_OUT_HI_B_2: LINE_RECEIVER4.6(2A) R54.1 ; also sheet 4
GEN_PURPOSE_OUT_HI_C_1: LINE_RECEIVER2.10(3A) R45.1 ; also sheet 4
GEN_PURPOSE_OUT_HI_C_2: LINE_RECEIVER4.10(3A) R57.1 ; also sheet 4
GEN_PURPOSE_OUT_LO_A_1: C50.2 LINE_RECEIVER2.1(1B) R40.1 R41.2 ; also sheet 4
GEN_PURPOSE_OUT_LO_A_2: C55.2 LINE_RECEIVER4.1(1B) R52.1 R53.2 ; also sheet 4
GEN_PURPOSE_OUT_LO_B_1: C51.2 LINE_RECEIVER2.7(2B) R43.1 R44.2 ; also sheet 4
GEN_PURPOSE_OUT_LO_B_2: C56.2 LINE_RECEIVER4.7(2B) R55.1 R56.2 ; also sheet 4
GEN_PURPOSE_OUT_LO_C_1: C52.2 LINE_RECEIVER2.9(3B) R46.1 R47.2 ; also sheet 4
GEN_PURPOSE_OUT_LO_C_2: C57.2 LINE_RECEIVER4.9(3B) R58.1 R59.2 ; also sheet 4
N$6: D7.C OPTOCOUPLER.7(ANODE4) R48.1
N$20: D1.C OPTOCOUPLER.1(ANODE1) R17.1
N$25: D2.C OPTOCOUPLER.3(ANODE2) R18.1
N$26: D3.C OPTOCOUPLER.5(ANODE3) R27.1
N$27: D4.C OPTOCOUPLER2.1(ANODE1) R28.1
N$28: D5.C OPTOCOUPLER2.3(ANODE2) R29.1
N$29: D6.C OPTOCOUPLER2.5(ANODE3) R30.1
S_GND: C47.1 C49.1 C50.1 C51.1 C52.1 C54.1 C55.1 C56.1 C57.1 C59.1 C60.1 C61.1 LEVEL_SHIFTER1.7(GND) LEVEL_SHIFTER2.7(GND) LEVEL_SHIFTER3.7(GND) LEVEL_SHIFTER4.7(GND) LINE_RECEIVER1.8(GND) LINE_RECEIVER2.8(GND) LINE_RECEIVER3.8(GND) LINE_RECEIVER4.8(GND) OPTOCOUPLER2.9(GND_2) OPTOCOUPLER2.16(GND) OPTOCOUPLER.9(GND_2) OPTOCOUPLER.16(GND) R41.1 R44.1 R47.1 R53.1 R56.1 R59.1 R79.1 R80.1 R81.1 R82.1 R83.1 R84.1 R85.1 R86.1 R87.1 R88.1 R89.1 R90.1 R91.1 R92.1 ; also sheet 1,2,4
SERVO_ALARM_AN_1: D7.A OPTOCOUPLER.8(CATHODE4) ; also sheet 4
SERVO_ALARM_GPIO: OPTOCOUPLER.11(V04) R49.1 ; also sheet 4
V_ON_5V_1: LINE_RECEIVER2.4(1/2EN) LINE_RECEIVER2.12(3/4EN) ; also sheet 1
V_ON_5V_3: LINE_RECEIVER1.4(1/2EN) LINE_RECEIVER1.12(3/4EN) ; also sheet 1
V_ON_5V_4: LINE_RECEIVER3.4(1/2EN) LINE_RECEIVER3.12(3/4EN) ; also sheet 1
V_ON_5V_5: LINE_RECEIVER4.4(1/2EN) LINE_RECEIVER4.12(3/4EN) ; also sheet 1
Unconnected: LEVEL_SHIFTER1.5(A4) LEVEL_SHIFTER1.6(NC_2) LEVEL_SHIFTER1.9(NC) LEVEL_SHIFTER1.10(B4) LEVEL_SHIFTER2.6(NC_2) LEVEL_SHIFTER2.9(NC) LEVEL_SHIFTER3.6(NC_2) LEVEL_SHIFTER3.9(NC) LEVEL_SHIFTER4.5(A4) LEVEL_SHIFTER4.6(NC_2) LEVEL_SHIFTER4.9(NC) LEVEL_SHIFTER4.10(B4) LINE_RECEIVER2.13(4Y) LINE_RECEIVER2.14(4A) LINE_RECEIVER2.15(4B) LINE_RECEIVER4.13(4Y) LINE_RECEIVER4.14(4A) LINE_RECEIVER4.15(4B) OPTOCOUPLER2.7(ANODE4) OPTOCOUPLER2.8(CATHODE4) OPTOCOUPLER2.11(V04)

### Notes on the sheet
- OUTPUTS FROM SERVO
- Line Receiver IC
  (Encoder Pulses)
- Level Shifter for 
  Receiver ICs'
- Photocoupler IC 
  (Alarm Code Signals)
- Line Receiver IC
  (General Purpose Output)

## Sheet 4 of 4
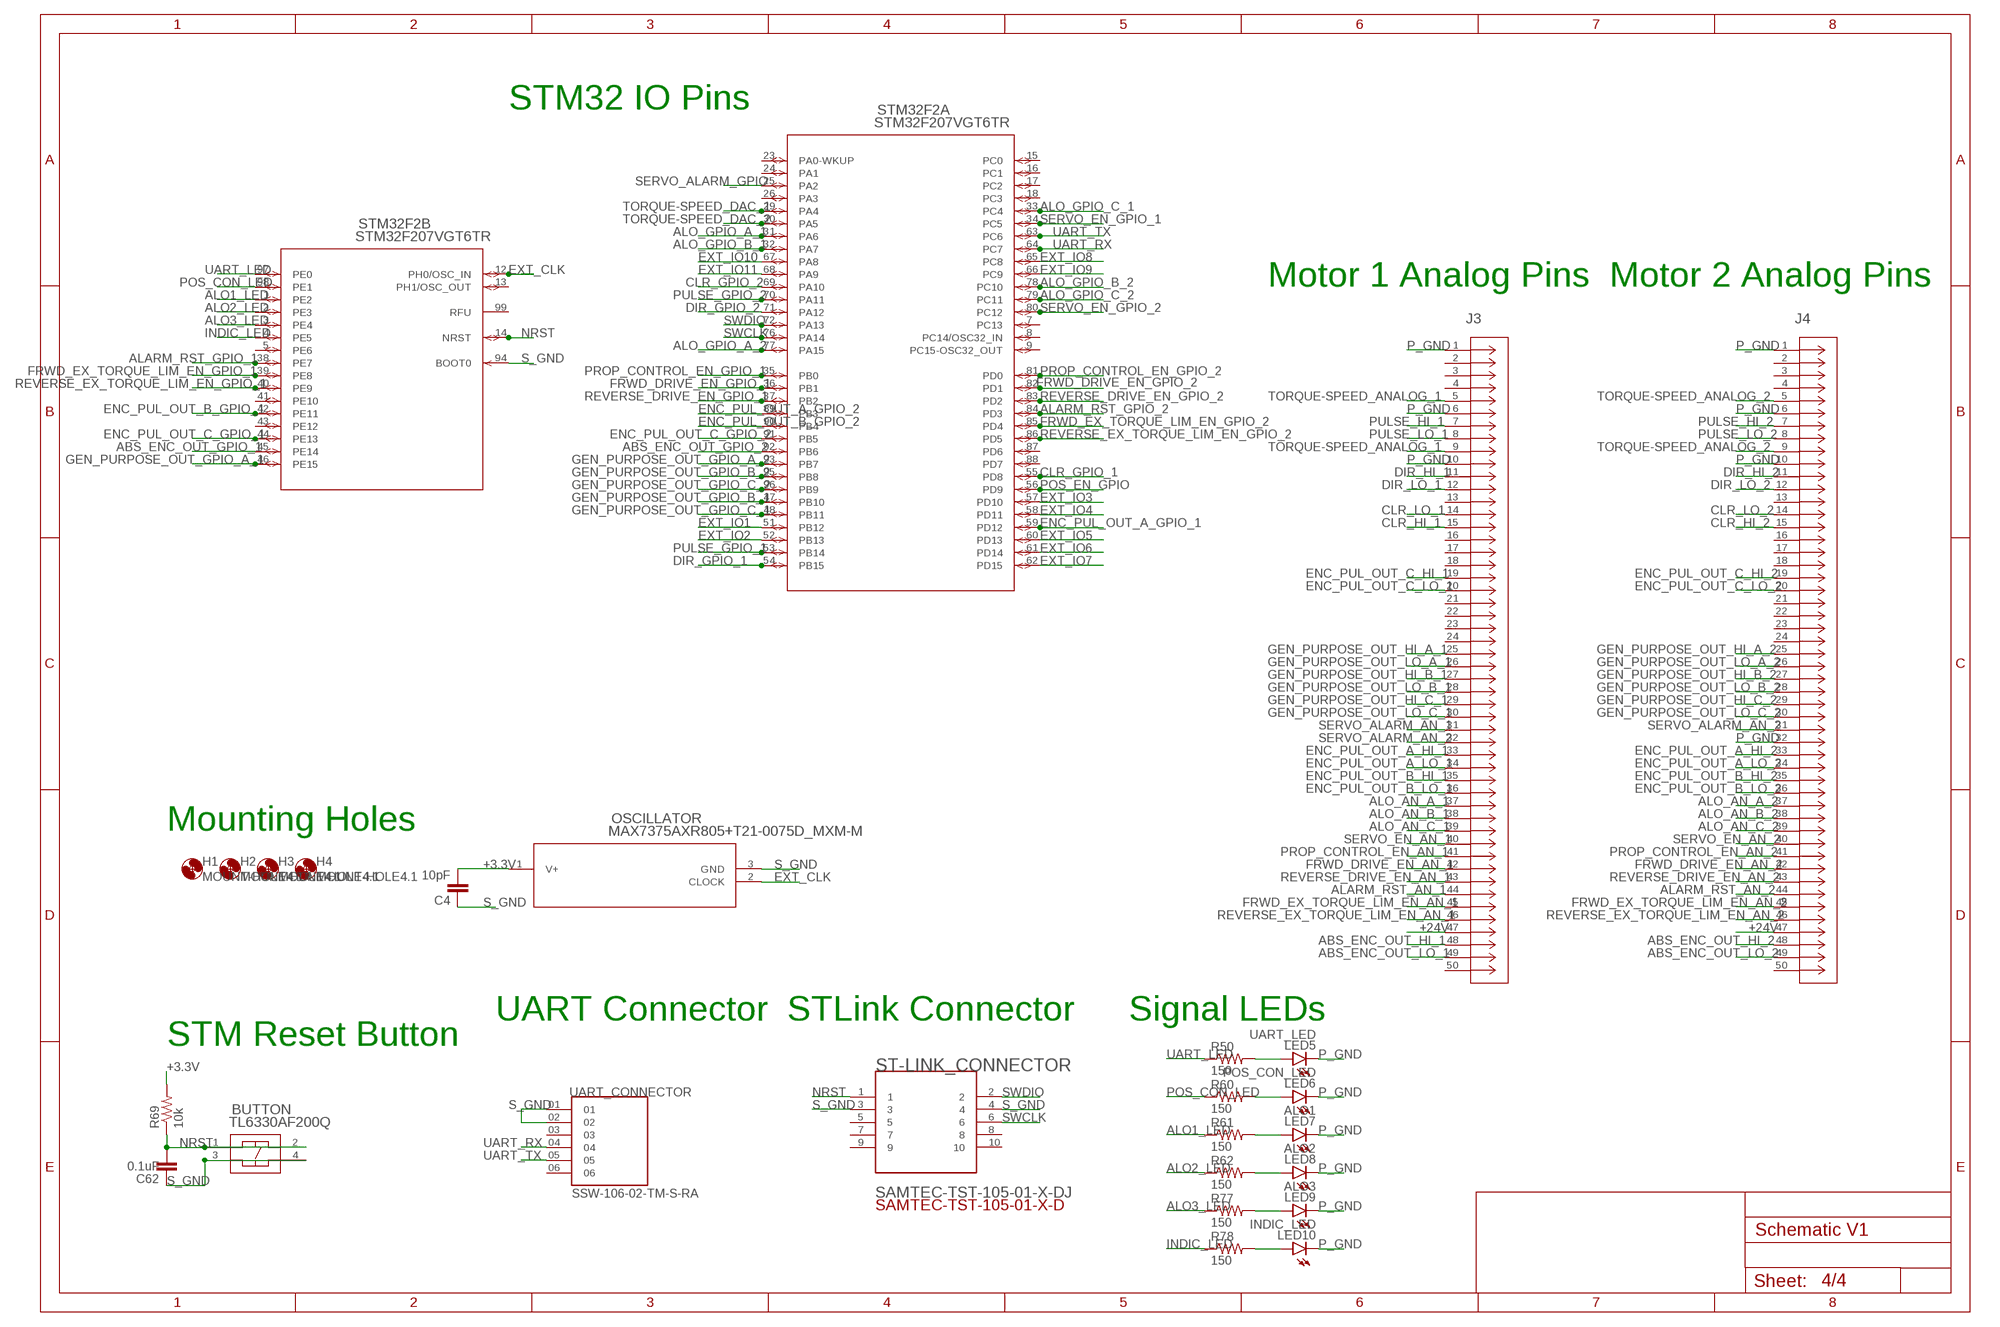
[diagram p3: schematic, sheet 4]

### Parts
BUTTON  TL6330AF200Q  [TL6330_EWI]
C4  10pF  10UF-0805-25V-10%  [0805]
C62  0.1uF  1.0UF-0805-25V-10%  [0805]
H1  MOUNT-HOLE4.1  [4,1]
H2  MOUNT-HOLE4.1  [4,1]
H3  MOUNT-HOLE4.1  [4,1]
H4  MOUNT-HOLE4.1  [4,1]
J3  DD50P564GTXLF  [CONN_DD50P564GTXLF_AMP]
J4  DD50P564GTXLF  [CONN_DD50P564GTXLF_AMP]
LED5  UART_LED  LEDCHIPLED_0805  [CHIPLED_0805]
LED6  POS_CON_LED  LEDCHIPLED_0805  [CHIPLED_0805]
LED7  ALO1  LEDCHIPLED_0805  [CHIPLED_0805]
LED8  ALO2  LEDCHIPLED_0805  [CHIPLED_0805]
LED9  ALO3  LEDCHIPLED_0805  [CHIPLED_0805]
LED10  INDIC_LED  LEDCHIPLED_0805  [CHIPLED_0805]
OSCILLATOR  MAX7375AXR805+T21-0075D_MXM-M  [21-0075D_MXM-M]
R50  150  R-US_R0805  [R0805]
R60  150  R-US_R0805  [R0805]
R61  150  R-US_R0805  [R0805]
R62  150  R-US_R0805  [R0805]
R69  10k  R-US_R0805  [R0805]
R77  150  R-US_R0805  [R0805]
R78  150  R-US_R0805  [R0805]
ST-LINK_CONNECTOR  SAMTEC-TST-105-01-X-DJ  [SAMTEC-TST-105-01-X-D]
UART_CONNECTOR  SSW-106-02-TM-S-RA  [SAMTEC_SSW-106-02-TM-S-RA]

### Nets
+3.3V: C4.2 OSCILLATOR.1(V+) R69.2 ; also sheet 1,3
+24V: J3.47 J4.47 ; also sheet 1,2,3
ABS_ENC_OUT_GPIO_1: STM32F2.45(B:PE14) ; also sheet 3
ABS_ENC_OUT_GPIO_2: STM32F2.92(A:PB6) ; also sheet 3
ABS_ENC_OUT_HI_1: J3.48 ; also sheet 3
ABS_ENC_OUT_HI_2: J4.48 ; also sheet 3
ABS_ENC_OUT_LO_1: J3.49 ; also sheet 3
ABS_ENC_OUT_LO_2: J4.49 ; also sheet 3
ALARM_RST_AN_1: J3.44 ; also sheet 2
ALARM_RST_AN_2: J4.44 ; also sheet 2
ALARM_RST_GPIO_1: STM32F2.38(B:PE7) ; also sheet 2
ALARM_RST_GPIO_2: STM32F2.84(A:PD3) ; also sheet 2
ALO1_LED: R61.1 STM32F2.1(B:PE2)
ALO2_LED: R62.1 STM32F2.2(B:PE3)
ALO3_LED: R77.1 STM32F2.3(B:PE4)
ALO_AN_A_1: J3.37 ; also sheet 3
ALO_AN_A_2: J4.37 ; also sheet 3
ALO_AN_B_1: J3.38 ; also sheet 3
ALO_AN_B_2: J4.38 ; also sheet 3
ALO_AN_C_1: J3.39 ; also sheet 3
ALO_AN_C_2: J4.39 ; also sheet 3
ALO_GPIO_A_1: STM32F2.31(A:PA6) ; also sheet 3
ALO_GPIO_A_2: STM32F2.77(A:PA15) ; also sheet 3
ALO_GPIO_B_1: STM32F2.32(A:PA7) ; also sheet 3
ALO_GPIO_B_2: STM32F2.78(A:PC10) ; also sheet 3
ALO_GPIO_C_1: STM32F2.33(A:PC4) ; also sheet 3
ALO_GPIO_C_2: STM32F2.79(A:PC11) ; also sheet 3
CLR_GPIO_1: STM32F2.55(A:PD8) ; also sheet 2
CLR_GPIO_2: STM32F2.69(A:PA10) ; also sheet 2
CLR_HI_1: J3.15 ; also sheet 2
CLR_HI_2: J4.15 ; also sheet 2
CLR_LO_1: J3.14 ; also sheet 2
CLR_LO_2: J4.14 ; also sheet 2
DIR_GPIO_1: STM32F2.54(A:PB15) ; also sheet 2
DIR_GPIO_2: STM32F2.71(A:PA12) ; also sheet 2
DIR_HI_1: J3.11 ; also sheet 2
DIR_HI_2: J4.11 ; also sheet 2
DIR_LO_1: J3.12 ; also sheet 2
DIR_LO_2: J4.12 ; also sheet 2
ENC_PUL_OUT_A_GPIO_1: STM32F2.59(A:PD12) ; also sheet 3
ENC_PUL_OUT_A_GPIO_2: STM32F2.89(A:PB3) ; also sheet 3
ENC_PUL_OUT_A_HI_1: J3.33 ; also sheet 3
ENC_PUL_OUT_A_HI_2: J4.33 ; also sheet 3
ENC_PUL_OUT_A_LO_1: J3.34 ; also sheet 3
ENC_PUL_OUT_A_LO_2: J4.34 ; also sheet 3
ENC_PUL_OUT_B_GPIO_1: STM32F2.42(B:PE11) ; also sheet 3
ENC_PUL_OUT_B_GPIO_2: STM32F2.90(A:PB4) ; also sheet 3
ENC_PUL_OUT_B_HI_1: J3.35 ; also sheet 3
ENC_PUL_OUT_B_HI_2: J4.35 ; also sheet 3
ENC_PUL_OUT_B_LO_1: J3.36 ; also sheet 3
ENC_PUL_OUT_B_LO_2: J4.36 ; also sheet 3
ENC_PUL_OUT_C_GPIO_1: STM32F2.44(B:PE13) ; also sheet 3
ENC_PUL_OUT_C_GPIO_2: STM32F2.91(A:PB5) ; also sheet 3
ENC_PUL_OUT_C_HI_1: J3.19 ; also sheet 3
ENC_PUL_OUT_C_HI_2: J4.19 ; also sheet 3
ENC_PUL_OUT_C_LO_1: J3.20 ; also sheet 3
ENC_PUL_OUT_C_LO_2: J4.20 ; also sheet 3
EXT_CLK: OSCILLATOR.2(CLOCK) STM32F2.12(B:PH0/OSC_IN)
EXT_IO1: STM32F2.51(A:PB12)
EXT_IO2: STM32F2.52(A:PB13)
EXT_IO3: STM32F2.57(A:PD10)
EXT_IO4: STM32F2.58(A:PD11)
EXT_IO5: STM32F2.60(A:PD13)
EXT_IO6: STM32F2.61(A:PD14)
EXT_IO7: STM32F2.62(A:PD15)
EXT_IO8: STM32F2.65(A:PC8)
EXT_IO9: STM32F2.66(A:PC9)
EXT_IO10: STM32F2.67(A:PA8)
EXT_IO11: STM32F2.68(A:PA9)
FRWD_DRIVE_EN_AN_1: J3.42 ; also sheet 2
FRWD_DRIVE_EN_AN_2: J4.42 ; also sheet 2
FRWD_DRIVE_EN_GPIO_1: STM32F2.36(A:PB1) ; also sheet 2
FRWD_DRIVE_EN_GPIO_2: STM32F2.82(A:PD1) ; also sheet 2
FRWD_EX_TORQUE_LIM_EN_AN_1: J3.45 ; also sheet 2
FRWD_EX_TORQUE_LIM_EN_AN_2: J4.45 ; also sheet 2
FRWD_EX_TORQUE_LIM_EN_GPIO_1: STM32F2.39(B:PE8) ; also sheet 2
FRWD_EX_TORQUE_LIM_EN_GPIO_2: STM32F2.85(A:PD4) ; also sheet 2
GEN_PURPOSE_OUT_GPIO_A_1: STM32F2.46(B:PE15) ; also sheet 3
GEN_PURPOSE_OUT_GPIO_A_2: STM32F2.93(A:PB7) ; also sheet 3
GEN_PURPOSE_OUT_GPIO_B_1: STM32F2.47(A:PB10) ; also sheet 3
GEN_PURPOSE_OUT_GPIO_B_2: STM32F2.95(A:PB8) ; also sheet 3
GEN_PURPOSE_OUT_GPIO_C_1: STM32F2.48(A:PB11) ; also sheet 3
GEN_PURPOSE_OUT_GPIO_C_2: STM32F2.96(A:PB9) ; also sheet 3
GEN_PURPOSE_OUT_HI_A_1: J3.25 ; also sheet 3
GEN_PURPOSE_OUT_HI_A_2: J4.25 ; also sheet 3
GEN_PURPOSE_OUT_HI_B_1: J3.27 ; also sheet 3
GEN_PURPOSE_OUT_HI_B_2: J4.27 ; also sheet 3
GEN_PURPOSE_OUT_HI_C_1: J3.29 ; also sheet 3
GEN_PURPOSE_OUT_HI_C_2: J4.29 ; also sheet 3
GEN_PURPOSE_OUT_LO_A_1: J3.26 ; also sheet 3
GEN_PURPOSE_OUT_LO_A_2: J4.26 ; also sheet 3
GEN_PURPOSE_OUT_LO_B_1: J3.28 ; also sheet 3
GEN_PURPOSE_OUT_LO_B_2: J4.28 ; also sheet 3
GEN_PURPOSE_OUT_LO_C_1: J3.30 ; also sheet 3
GEN_PURPOSE_OUT_LO_C_2: J4.30 ; also sheet 3
INDIC_LED: R78.1 STM32F2.4(B:PE5)
N$9: LED5.A R50.2
N$10: LED6.A R60.2
N$12: LED7.A R61.2
N$14: LED8.A R62.2
N$16: LED9.A R77.2
N$19: LED10.A R78.2
NRST: BUTTON.1 BUTTON.2 C62.2 R69.1 ST-LINK_CONNECTOR.1 STM32F2.14(B:NRST)
P_GND: J3.1 J3.6 J3.10 J4.1 J4.6 J4.10 J4.32 LED5.C LED6.C LED7.C LED8.C LED9.C LED10.C ; also sheet 1,2
POS_CON_LED: R60.1 STM32F2.98(B:PE1)
POS_EN_GPIO: STM32F2.56(A:PD9) ; also sheet 2
PROP_CONTROL_EN_AN_1: J3.41 ; also sheet 2
PROP_CONTROL_EN_AN_2: J4.41 ; also sheet 2
PROP_CONTROL_EN_GPIO_1: STM32F2.35(A:PB0) ; also sheet 2
PROP_CONTROL_EN_GPIO_2: STM32F2.81(A:PD0) ; also sheet 2
PULSE_GPIO_1: STM32F2.53(A:PB14) ; also sheet 2
PULSE_GPIO_2: STM32F2.70(A:PA11) ; also sheet 2
PULSE_HI_1: J3.7 ; also sheet 2
PULSE_HI_2: J4.7 ; also sheet 2
PULSE_LO_1: J3.8 ; also sheet 2
PULSE_LO_2: J4.8 ; also sheet 2
REVERSE_DRIVE_EN_AN_1: J3.43 ; also sheet 2
REVERSE_DRIVE_EN_AN_2: J4.43 ; also sheet 2
REVERSE_DRIVE_EN_GPIO_1: STM32F2.37(A:PB2) ; also sheet 2
REVERSE_DRIVE_EN_GPIO_2: STM32F2.83(A:PD2) ; also sheet 2
REVERSE_EX_TORQUE_LIM_EN_AN_1: J3.46 ; also sheet 2
REVERSE_EX_TORQUE_LIM_EN_AN_2: J4.46 ; also sheet 2
REVERSE_EX_TORQUE_LIM_EN_GPIO_1: STM32F2.40(B:PE9) ; also sheet 2
REVERSE_EX_TORQUE_LIM_EN_GPIO_2: STM32F2.86(A:PD5) ; also sheet 2
S_GND: BUTTON.3 BUTTON.4 C4.1 C62.1 OSCILLATOR.3(GND) ST-LINK_CONNECTOR.3 ST-LINK_CONNECTOR.4 STM32F2.94(B:BOOT0) UART_CONNECTOR.01 UART_CONNECTOR.02 ; also sheet 1,2,3
SERVO_ALARM_AN_1: J3.31 ; also sheet 3
SERVO_ALARM_AN_2: J3.32 J4.31
SERVO_ALARM_GPIO: STM32F2.25(A:PA2) ; also sheet 3
SERVO_EN_AN_1: J3.40 ; also sheet 2
SERVO_EN_AN_2: J4.40 ; also sheet 2
SERVO_EN_GPIO_1: STM32F2.34(A:PC5) ; also sheet 2
SERVO_EN_GPIO_2: STM32F2.80(A:PC12) ; also sheet 2
SWCLK: ST-LINK_CONNECTOR.6 STM32F2.76(A:PA14)
SWDIO: ST-LINK_CONNECTOR.2 STM32F2.72(A:PA13)
TORQUE-SPEED_ANALOG_1: J3.5 J3.9 ; also sheet 2
TORQUE-SPEED_ANALOG_2: J4.5 J4.9 ; also sheet 2
TORQUE-SPEED_DAC_1: STM32F2.29(A:PA4) ; also sheet 2
TORQUE-SPEED_DAC_2: STM32F2.30(A:PA5) ; also sheet 2
UART_LED: R50.1 STM32F2.97(B:PE0)
UART_RX: STM32F2.64(A:PC7) UART_CONNECTOR.04
UART_TX: STM32F2.63(A:PC6) UART_CONNECTOR.05
Unconnected: J3.2 J3.3 J3.4 J3.13 J3.16 J3.17 J3.18 J3.21 J3.22 J3.23 J3.24 J3.50 J4.2 J4.3 J4.4 J4.13 J4.16 J4.17 J4.18 J4.21 J4.22 J4.23 J4.24 J4.50 ST-LINK_CONNECTOR.5 ST-LINK_CONNECTOR.7 ST-LINK_CONNECTOR.8 ST-LINK_CONNECTOR.9 ST-LINK_CONNECTOR.10 STM32F2.5(B:PE6) STM32F2.7(A:PC13) STM32F2.8(A:PC14/OSC32_IN) STM32F2.9(A:PC15-OSC32_OUT) STM32F2.13(B:PH1/OSC_OUT) STM32F2.15(A:PC0) STM32F2.16(A:PC1) STM32F2.17(A:PC2) STM32F2.18(A:PC3) STM32F2.23(A:PA0-WKUP) STM32F2.24(A:PA1) STM32F2.26(A:PA3) STM32F2.41(B:PE10) STM32F2.43(B:PE12) STM32F2.87(A:PD6) STM32F2.88(A:PD7) STM32F2.99(B:RFU) UART_CONNECTOR.03 UART_CONNECTOR.06

### Notes on the sheet
- STM32 IO Pins
- Motor 1 Analog Pins | Motor 2 Analog Pins
- Mounting Holes
- UART Connector | STLink Connector | Signal LEDs
- STM Reset Button

## Library data of the parts
0.01UF_C7 = SSW-130-01-G-S:GRM2195C1H103JA01D; COPYRIGHT: Copyright (C) 2024 Ultra Librarian. All rights reserved.; MANUFACTURER_PART_NUMBER: GRM2195C1H103JA01D; MFR_NAME: Murata
5V = SSW-130-01-G-S:LM2678S-5.0/NOPB; COPYRIGHT: Copyright (C) 2024 Ultra Librarian. All rights reserved.; MANUFACTURER_PART_NUMBER: LM2678S-5.0/NOPB; MFR_NAME: Texas Instruments; TYPE: LM2678S-12
10UH_L1 = SSW-130-01-G-S:SRP1270-100M; COPYRIGHT: Copyright (C) 2024 Ultra Librarian. All rights reserved.; MANUFACTURER_PART_NUMBER: SRP1270-100M; MFR_NAME: Bourns Electronics
14_JACK = SSW-130-01-G-S:PJ-025: EIAJ-5 Center Pin, 3.0 A, Right Angle, Through Hole, Kinked Pins, Dc Power Jack Connector; MANUFACTURER: CUI INC; STANDARD: Manufacturer recommendations
180UF = SSW-130-01-G-S:20SVPF180M; COPYRIGHT: Copyright (C) 2024 Ultra Librarian. All rights reserved.; MANUFACTURER_PART_NUMBER: 20SVPF180M; MFR_NAME: Panasonic
330UF_C3 = SSW-130-01-G-S:10SVPC330M; COPYRIGHT: Copyright (C) 2024 Ultra Librarian. All rights reserved.; MANUFACTURER_PART_NUMBER: 10SVPC330M; MFR_NAME: Panasonic
-15V = SSW-130-01-G-S:LM43601PWPR; COPYRIGHT: Copyright (C) 2024 Ultra Librarian. All rights reserved.; MANUFACTURER_PART_NUMBER: LM43601PWPR; MFR_NAME: Texas Instruments
BUTTON = SSW-130-01-G-S:TL6330AF200Q; COPYRIGHT: Copyright (C) 2024 Ultra Librarian. All rights reserved.; MANUFACTURER_PART_NUMBER: TL6330AF200Q; MFR_NAME: E-Switch
C1 = SparkFun-Capacitors:1.0UF: 1µF ceramic capacitors A capacitor is a passive two-terminal electrical component used to store electrical energy temporarily in an electric field.; PROD_ID: CAP-11625; VALUE: 1.0uF
C4 = SparkFun-Capacitors:10UF: 10.0µF ceramic capacitors A capacitor is a passive two-terminal electrical component used to store electrical energy temporarily in an electric field.; PROD_ID: CAP-14259; VALUE: 10uF
C5 C6 = SparkFun-Capacitors:1.0UF: 1µF ceramic capacitors A capacitor is a passive two-terminal electrical component used to store electrical energy temporarily in an electric field.; PROD_ID: CAP-11625
C8 = SSW-130-01-G-S:UWD1V680MCL1GS; COPYRIGHT: Copyright (C) 2024 Ultra Librarian. All rights reserved.; MANUFACTURER_PART_NUMBER: UWD1V680MCL1GS; MFR_NAME: Nichicon
C9 C12 = SparkFun-Capacitors:4.7UF: 4.7µF ceramic capacitors A capacitor is a passive two-terminal electrical component used to store electrical energy temporarily in an electric field.; PROD_ID: CAP-15457
C10 C34 C35 = SparkFun-Capacitors:2.2UF: 2.2µF ceramic capacitors A capacitor is a passive two-terminal electrical component used to store electrical energy temporarily in an electric field.; PROD_ID: CAP-11624
C11 = SparkFun-Capacitors:470NF: 0.47uF/470nF ceramic capacitors A capacitor is a passive two-terminal electrical component used to store electrical energy temporarily in an electric field.; PROD_ID: CAP-16570
C13 C14 = SparkFun-Capacitors:4.7UF: 4.7µF ceramic capacitors A capacitor is a passive two-terminal electrical component used to store electrical energy temporarily in an electric field.; PROD_ID: CAP-15457; VALUE: 4.7uF
C15-C30 C32 C50-C52 C55-C57 C60-C62 = SparkFun-Capacitors:1.0UF: 1µF ceramic capacitors A capacitor is a passive two-terminal electrical component used to store electrical energy temporarily in an electric field.; PROD_ID: CAP-08064; VALUE: 1.0uF
C31 C33 C46-C49 C54 C59 = SparkFun-Capacitors:1.0UF: 1µF ceramic capacitors A capacitor is a passive two-terminal electrical component used to store electrical energy temporarily in an electric field.; PROD_ID: CAP-08064
C36 = SparkFun-Capacitors:2.2UF: 2.2µF ceramic capacitors A capacitor is a passive two-terminal electrical component used to store electrical energy temporarily in an electric field.; PROD_ID: CAP-11624; VALUE: 2.2uF
D1-D7 = SparkFun-DiscreteSemi:DIODE: Diode These are standard reverse protection diodes and small signal diodes. SparkFun Products: SparkFun SparkPunk Sound Kit <https://www.sparkfun.com/products/11177> SparkFun ESP8266 Thing <https://www.sparkfun.com/products/13231>; PROD_ID: DIO-09646
DIODE = SSW-130-01-G-S:CDBC520-G; COPYRIGHT: Copyright (C) 2024 Ultra Librarian. All rights reserved.; MANUFACTURER_PART_NUMBER: CDBC520-G; MFR_NAME: Comchip
H1-H4 = holes:MOUNT-HOLE: MOUNTING HOLE with drill center marker
J1 = SSW-130-01-G-S:PJ-202AH: 2.0 mm Center Pin, 5.0 A, Right Angle, Through Hole, Kinked Pins, Dc Power Jack Connector; MANUFACTURER: CUI INC; PART_REV: 1.02; STANDARD: Manufacturer recommendations
J2 J5 = SSW-130-01-G-S:TSM-103-01-L-SV
J3 J4 = SSW-130-01-G-S:DD50P564GTXLF; COPYRIGHT: Copyright (C) 2024 Ultra Librarian. All rights reserved.; MANUFACTURER_PART_NUMBER: DD50P564GTXLF; MFR_NAME: Amphenol ICC; TYPE: D-Sub Connector Assemblies
L2 L4 L5 = SSW-130-01-G-S:BLM21PG600SN1D; COPYRIGHT: Copyright (C) 2024 Ultra Librarian. All rights reserved.; MANUFACTURER_PART_NUMBER: BLM21PG600SN1D; MFR_NAME: Murata
L3 = SSW-130-01-G-S:VLS201610CX-220M-1; MANUFACTURER: TDK; MAXIMUM_PACKAGE_HEIGHT: 1.0 mm; PARTREV: N/A; STANDARD: Manufacturer Recommendations
LDO = SSW-130-01-G-S:TLV1117LV33DCYR: 1-A, low-dropout voltage regulator 4-SOT-223 -40 to 125; MANUFACTURER: Texas Instruments; MAXIMUM_PACKAGE_HEIGHT: 1.80 mm; PARTREV: B; STANDARD: IPC-7351B
LED1-LED10 = led:LED: LED OSRAM: - CHIPLED LG R971, LG N971, LY N971, LG Q971, LY Q971, LO R971, LY R971 LH N974, LH R974 LS Q976, LO Q976, LY Q976 LO Q996 - Hyper CHIPLED LW Q18S LB Q993, LB Q99A, LB R99A - SideLED LS A670, LO A670, LY A670, LG A670, LP A670 LB A673, LV A673, LT A673, LW A673 LH A674 LY A675 LS A676, LA A676, LO A676, LY A676, LW A676 LS A679, LY A679, LG A679 - Hyper Micro SIDELED® LS Y876, LA Y876, LO Y876, LY Y876 LT Y87S - SmartLED LW L88C, LW L88S LB L89C, LB L89S, LG L890 LS L89K, LO L89K, LY L89K LS L896, LA L896, LO L896, LY L896 - TOPLED LS T670, LO T670, LY T670, LG T670, LP T670 LSG T670, LSP T670, LSY T670, LOP T670, LYG T670 LG T671, LOG T671, LSG T671 LB T673, LV T673, LT T673, LW T673 LH T674 LS T676, LA T676, LO T676, LY T676, LB T676, LH T676, LSB T676, LW T676 LB T67C, LV T67C, LT T67C, LS T67K, LO T67K, LY T67K, LW E67C LS E67B, LA E67B, LO E67B, LY E67B, LB E67C, LV E67C, LT E67C LW T67C LS T679, LY T679, LG T679 LS T770, LO T770, LY T770, LG T770, LP T770 LB T773, LV T773, LT T773, LW T773 LH T774 LS E675, LA E675, LY E675, LS T675 LS T776, LA T776, LO T776, LY T776, LB T776 LHGB T686 LT T68C, LB T68C - Hyper Mini TOPLED® LB M676 - Mini TOPLED Santana® LG M470 LS M47K, LO M47K, LY M47K Source: http://www.osram.convergy.de LUXEON: - LUMILED® LXK2-PW12-R00, LXK2-PW12-S00, LXK2-PW14-U00, LXK2-PW14-V00 LXK2-PM12-R00, LXK2-PM12-S00, LXK2-PM14-U00 LXK2-PE12-Q00, LXK2-PE12-R00, LXK2-PE12-S00, LXK2-PE14-T00, LXK2-PE14-U00 LXK2-PB12-K00, LXK2-PB12-L00, LXK2-PB12-M00, LXK2-PB14-N00, LXK2-PB14-P00, LXK2-PB14-Q00 LXK2-PR12-L00, LXK2-PR12-M00, LXK2-PR14-Q00, LXK2-PR14-R00 LXK2-PD12-Q00, LXK2-PD12-R00, LXK2-PD12-S00 LXK2-PH12-R00, LXK2-PH12-S00 LXK2-PL12-P00, LXK2-PL12-Q00, LXK2-PL12-R00 Source: www.luxeon.com KINGBRIGHT: KA-3528ASYC Source: www.kingbright.com
LEVEL_SHIFTER1-LEVEL_SHIFTER4 = SSW-130-01-G-S:RS0104YQ; COPYRIGHT: Copyright (C) 2024 Ultra Librarian. All rights reserved.; MANUFACTURER_PART_NUMBER: RS0104YQ; MFR_NAME: RUNIC Technology; TYPE: Logic
LINE_DRIVER1 LINE_DRIVER2 = SSW-130-01-G-S:SN75ALS174ADWR; COPYRIGHT: Copyright (C) 2024 Ultra Librarian. All rights reserved.; MANUFACTURER_PART_NUMBER: SN75ALS174ADWR; MFR_NAME: Texas Instruments
LINE_RECEIVER1-LINE_RECEIVER4 = SSW-130-01-G-S:SN65LBC175AD; COPYRIGHT: Copyright (C) 2024 Ultra Librarian. All rights reserved.; MANUFACTURER_PART_NUMBER: SN65LBC175AD; MFR_NAME: Texas Instruments
NPN NPN2 = SSW-130-01-G-S:SN75468DR; COPYRIGHT: Copyright (C) 2024 Ultra Librarian. All rights reserved.; MANUFACTURER_PART_NUMBER: SN75468DR; MFR_NAME: Texas Instruments; REFDES: RefDes; TYPE: TYPE
OP_AMP = SSW-130-01-G-S:OPA4205APWR; COPYRIGHT: Copyright (C) 2024 Ultra Librarian. All rights reserved.; MANUFACTURER_PART_NUMBER: OPA4205APWR; MFR_NAME: Texas Instruments; TYPE: Linear
OPTOCOUPLER OPTOCOUPLER2 = SSW-130-01-G-S:ACSL-6400-00TE; COPYRIGHT: Copyright (C) 2024 Ultra Librarian. All rights reserved.; MANUFACTURER_PART_NUMBER: ACSL-6400-00TE; MFR_NAME: Broadcom
OSCILLATOR = SSW-130-01-G-S:MAX7375AXR805+T; COPYRIGHT: Copyright (C) 2024 Ultra Librarian. All rights reserved.; MANUFACTURER_PART_NUMBER: MAX7375AXR805+T; MFR_NAME: Analog Devices Inc
R1-R6 R8-R92 = rcl:R-US_: RESISTOR, American symbol; SPICEPREFIX: R
R7 = SSW-130-01-G-S:3352T-1-105LF; COPYRIGHT: Copyright (C) 2024 Ultra Librarian. All rights reserved.; MANUFACTURER_PART_NUMBER: 3352T-1-105LF; MFR_NAME: Bourns Electronics
ST-LINK_CONNECTOR = SSW-130-01-G-S:SAMTEC-TST-105-01-X-D
STM32F2 = SSW-130-01-G-S:STM32F207VGT6TR; COPYRIGHT: Copyright (C) 2024 Ultra Librarian. All rights reserved.; MANUFACTURER_PART_NUMBER: STM32F207VGT6TR; MFR_NAME: STMicroelectronics
TP1-TP6 = SparkFun-Connectors:TEST-POINT: SparkFun Test Points Bare copper test points for troubleshooting or In-Circuit-Testing. These are used by our Production team for verifying production board runs using pogo-pins on test beds. SparkFun Products: SparkFun LSM9DS1 Breakout <https://www.sparkfun.com/products/13284> SparkFun PSOC <https://www.sparkfun.com/products/13714> SparkFun Load Cell Amplifier <https://www.sparkfun.com/products/13879>
UART_CONNECTOR = SSW-130-01-G-S:SSW-106-02-TM-S-RA; MANUFACTURER: Samtec; PARTREV: R; STANDARD: Manufacturer Recommendations